# Altium schematic sheet SFP_PortA.SchDoc: Small Form Factor Pluggable Plus
size B; DocumentNumber: 14; SheetNumber: 14; SheetTotal: 46
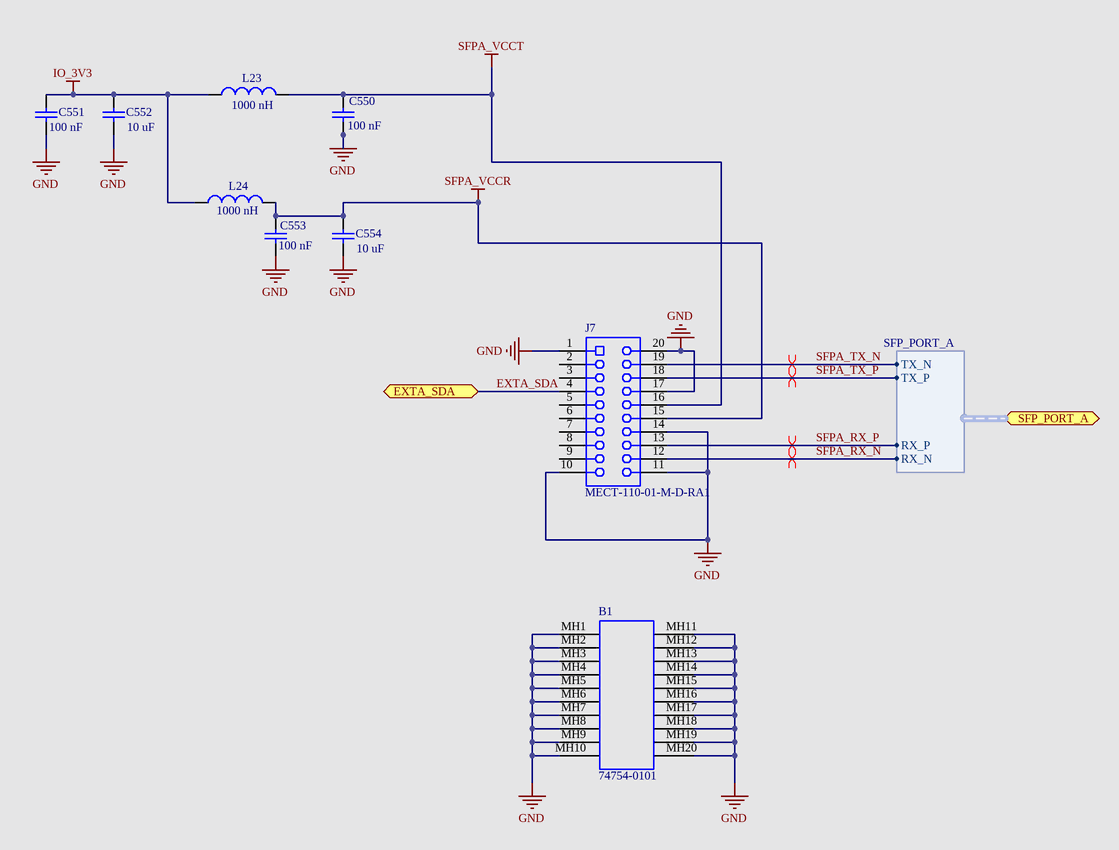
[diagram p0: SFP_PortA.SchDoc]

## Parts
B1  74754-0101  [MOLX-74754-0101_V]
C550  Capacitance: 100 nF  [CAPC1005X55X10LL05]  (hidden comment: C1005X7R1E104M)
C551  Capacitance: 100 nF  [CAPC1005X55X10LL05]  (hidden comment: C1005X7R1E104M)
C552  Capacitance: 10 uF  [CAPC2013X100X20NL20]  (hidden comment: C2012X5R1C106K085AC)
C553  Capacitance: 100 nF  [CAPC1005X55X10LL05]  (hidden comment: C1005X7R1E104M)
C554  Capacitance: 10 uF  [CAPC2013X100X20NL20]  (hidden comment: C2012X5R1C106K085AC)
J7  MECT-110-01-M-D-RA1  [SMTC-MECT-110-01-M-D-RA1_V]
L23  Inductance: 1000 nH  [COIL-1008CS_V]  (hidden comment: 1008CS-102XFLC)
L24  Inductance: 1000 nH  [COIL-1008CS_V]  (hidden comment: 1008CS-102XFLC)

## Ports
EXTA_SDA (bidir), SFP_PORT_A (harness SFP_PORT_A)

## Harnesses
SFP_PORT_A: TX_P, TX_N, RX_P, RX_N

## Nets
GND: B1.MH1 B1.MH2 B1.MH3 B1.MH4 B1.MH5 B1.MH6 B1.MH7 B1.MH8 B1.MH9 B1.MH10 B1.MH11 B1.MH12 B1.MH13 B1.MH14 B1.MH15 B1.MH16 B1.MH17 B1.MH18 B1.MH19 B1.MH20 C550.1 C551.1 C552.1 C553.1 C554.1 J7.1 J7.10 J7.11 J7.14 J7.17 J7.20
IO_3V3: C551.2 C552.2 L23.1 L24.1
SFPA_VCCR: C553.2 C554.2 J7.15 L24.2
SFPA_VCCT: C550.2 J7.16 L23.2
EXTA_SDA: J7.4 ; port EXTA_SDA
SFPA_RX_N: J7.12 ; port SFP_PORT_A.RX_N
SFPA_RX_P: J7.13 ; port SFP_PORT_A.RX_P
SFPA_TX_N: J7.19 ; port SFP_PORT_A.TX_N
SFPA_TX_P: J7.18 ; port SFP_PORT_A.TX_P

Not connected (* = marked no-connect by the designer): J7 2 3 5 6 7 8 9

## Layout directives
differential pair: SFPA_RX_N, SFPA_RX_P, SFPA_TX_N, SFPA_TX_P

## Notes on the sheet
- Title
- Size:
- Date:
- B
- Number:
- Time:
- Revision:
- Sheet
- of
- File:

## Library data of the parts
B1 = CMP-1704-00003-1: SFP+ Cage, Single Port, Height 10.85 mm, Tail Height 3.05 mm, -40 to 85 degC, RoHS, Tray; Manufacturer: Molex; ComponentLink1URL: http://www.molex.com/; PartNumber: 74754-0101; Mounting Technology: Through Hole; PackageDescription: SFP+ Cage, Single Port, Height 10.85 mm, Tail Height 3.05 mm; ComponentLink2Description: Datasheet; DatasheetVersion: Rev. Jul-15; PackageVersion: Rev. J, 02/2015; ComponentLink1Description: Manufacturer URL; ComponentLink2URL: http://www.molex.com/webdocs/datasheets/pdf/en-us/0747540101_IO_CONNECTORS.pdf; ComponentLink3Description: Package Specification; PackageReference: 74754-0101; ComponentLink3URL: http://www.molex.com/pdm_docs/sd/747540101_sd.pdf
C550 C551 C553 = CMP-1663-00009-2: Chip Capacitor, 0.1 uF, +/- 20%, 25 V, -55 to 125 degC, 0402 (1005 Metric), RoHS, Tape and Reel; Type (Capacitors): X7R; Voltage Rating: 25 V; Case\/Package: 0402; Tolerance: 20%; Max Operating Temperature: 125 degC; ComponentLink2URL: http://www.farnell.com/datasheets/1571323.pdf; ComponentLink1URL: http://www.tdk.com/; RoHSCompliant: true; Packaging: Tape and Reel; Mounting Technology: Surface Mount; ComponentLink2Description: Datasheet; Case Code (Imperial): 0402; DatasheetVersion: 09/2011; ComponentLink1Description: Manufacturer URL; PackageDescription: 2-Pin Surface Mount Device, Body 1 x 0.5 mm; PackageReference: 0402; Min Operating Temperature: -55 degC; Case Code (Metric): 1005; Height: 0.5 mm; Package Quantity: 10000; Width: 0.5 mm; Pins: 2; Voltage Rating (DC): 25 V; PartNumber: C1005X7R1E104M; Mount: Surface Mount; Length: 1 mm
C552 C554 = CMP-1663-00007-1: Chip Capacitor, 10 uF, +/- 10%, 16 V, -55 to 85 degC, 0805 (2012 Metric), RoHS, Tape and Reel; Type (Capacitors): X5R; Voltage Rating (DC): 16 V; Case\/Package: 0805; Tolerance: 10%; Mounting Technology: Surface Mount; Min Operating Temperature: -55 degC; Length: 2 mm; Case Code (Metric): 2012; PackageReference: 0805; Voltage Rating: 16 V; RoHSCompliant: true; ComponentLink1Description: Manufacturer URL; Width: 1.25 mm; ComponentLink1URL: http://www.tdk.com/; Max Operating Temperature: 85 degC; REACH SVHC: No SVHC; Mount: Surface Mount; ComponentLink2URL: https://product.tdk.com/info/en/catalog/datasheets/mlcc_commercial_general_en.pdf; ComponentLink2Description: Datasheet; Pins: 2; Packaging: Tape and Reel; Height: 0.85 mm; Package Quantity: 1; DatasheetVersion: 03/2015; Case Code (Imperial): 0805; PackageDescription: 2-Pin Surface Mount Device, Body 2 x 1.25 mm
J7 = CMP-1707-00001-1: Female Transceiver Interface, Pitch 0.8 mm, 2 x 10 Position, Height 5.2 mm, -55 to 125 degC, RoHS, Tube; Manufacturer: Samtec; ComponentLink1URL: http://www.samtec.com/; ComponentLink2Description: Datasheet; ComponentLink2URL: http://suddendocs.samtec.com/catalog_english/mect.pdf; PartNumber: MECT-110-01-M-D-RA1; PackageDescription: Female Transceiver Interface, Pitch 0.8 mm, 2 x 10 Position, Height 5.2 mm; Mounting Technology: Surface Mount; ComponentLink3Description: Package Specification; ComponentLink1Description: Manufacturer URL; DatasheetVersion: Rev. Feb-16; PackageReference: MECT-110-01-M-D-RA1; PackageVersion: Rev. H, 06/2016; ComponentLink3URL: http://suddendocs.samtec.com/prints/mect-1xx-xx-xx-xx-d-rax-xx-footprint.pdf
L23 L24 = CMP-1716-00001-2: Chip Inductor, 1000 nH, +/- 1%, -40 to 125 degC, 2-Pin SMD, RoHS, Tape and Reel; DatasheetVersion: 01/2012; ComponentLink2URL: http://datasheet.octopart.com/1008CS-102XFLC-Coilcraft-datasheet-10791557.pdf; ComponentLink1Description: Manufacturer URL; PartNumber: 1008CS-102XFLC; ComponentLink1URL: http://www.coilcraft.com/; PackageDescription: 2-Pin Surface Mount Device, Body 2.92 x 2.79 mm; RoHSCompliant: False; ComponentLink2Description: Datasheet; Mounting Technology: Surface Mount